# EAGLE design SC4541 (EAGLE 7.6.0)
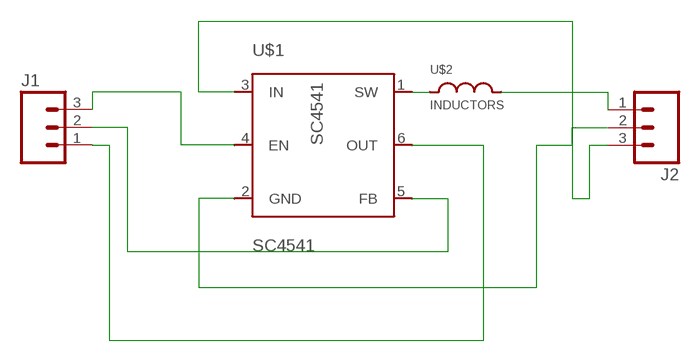
[diagram p0: schematic, sheet 1]

## Parts
J1  M03PTH  [1X03]
J2  M03PTH  [1X03]
U$1  SC4541  [SOT23-6]
U$2  INDUCTORS  [1212_3X3]

## Nets
N$1: J1.3 U$1.4(EN)
N$2: J1.2 U$1.5(FB)
N$3: U$1.1(SW) U$2.P$2
N$4: J1.1 U$1.6(OUT)
N$5: J2.2 U$1.2(GND)
N$6: J2.3 U$1.3(IN)
N$8: J2.1 U$2.P$1

## Library data of the parts
J1 J2 = SparkFun-Connectors:M03: Header 3 Standard 3-pin 0.1" header. Use with straight break away headers (SKU : PRT-00116), right angle break away headers (PRT-00553), swiss pins (PRT-00743), machine pins (PRT-00117), and female headers (PRT-00115). Molex polarized connector foot print use with SKU : PRT-08232 with associated crimp pins and housings.
U$1 = _my-parts:SC4541
U$2 = _my-parts:INDUCTORS

## Board
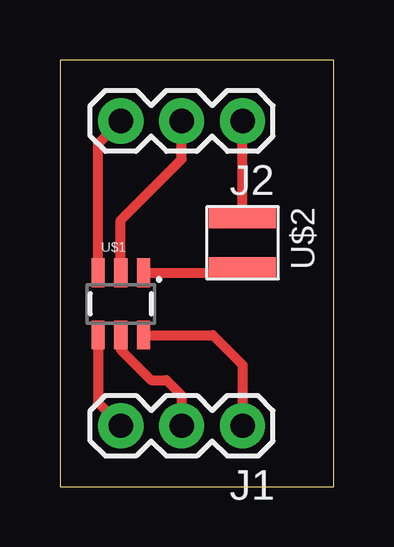
[diagram p1: board, top side]

Size 11.43 x 17.78 mm. Coordinates in mm from the lower left corner, seen from the top.
Outline: 0,0 11.43,0 11.43,17.78 0,17.78 0,0
Copper layers (1*16): Top 0.035mm / dielectric 1.5mm / Bottom 0.035mm
Design rules "default": minimum track width 10mil, minimum drill 24mil, track to track 8mil, track to pad 8mil, pad to pad 8mil, via to via 8mil, smd to smd 8mil, copper to edge 40mil, drill to drill 8mil, minimum pad ring 10mil, minimum via ring 8mil, stop-mask expansion 4mil, vias tented up to drill 0mil, thermal gap 10mil

### Footprints (pad centres in the part's own frame; a part is rotated, then mirrored left to right if it is on the bottom)
1X03 = drill 1.016 pad 1.88: 1 0,0; 2 2.54,0; 3 5.08,0
SOT23-6 = smd 0.55 x 1.2: 1 0.95,1.3; 2 0,1.3; 3 -0.95,1.3; 4 -0.95,-1.3; 5 0,-1.3; 6 0.95,-1.3
1212_3X3 = smd 0.9 x 2.8: P$1 -1.05,0; P$2 1.05,0

### Placement (x,y rotation side)
J1  7.62,2.54 180 top
J2  7.62,15.24 180 top
U$1  2.54,7.62 0 top
U$2  7.62,10.16 270 top

### Tracks (layer width: path | path; a pad name or v marks a point on that pad's centre or on a via)
N$1
  Top 0.406: U$1.4 1.59,3.49 J1.3
N$2
  Top 0.406: U$1.5 2.54,5.71 3.81,4.45 4.45,4.45 5.08,3.81 J1.2
N$3
  Top 0.406: U$1.1 7.43,8.92 U$2.P$2
N$4
  Top 0.406: U$1.6 6.38,6.32 7.62,5.08 J1.1
N$5
  Top 0.406: U$1.2 2.54,11.11 5.08,13.65 J2.2
N$6
  Top 0.406: U$1.3 1.59,14.29 J2.3
N$8
  Top 0.406: U$2.P$1 J2.1